# Altium schematic sheet Sensor Bank.SchDoc
size A4; DocumentNumber: 6; SheetNumber: 6; SheetTotal: 8
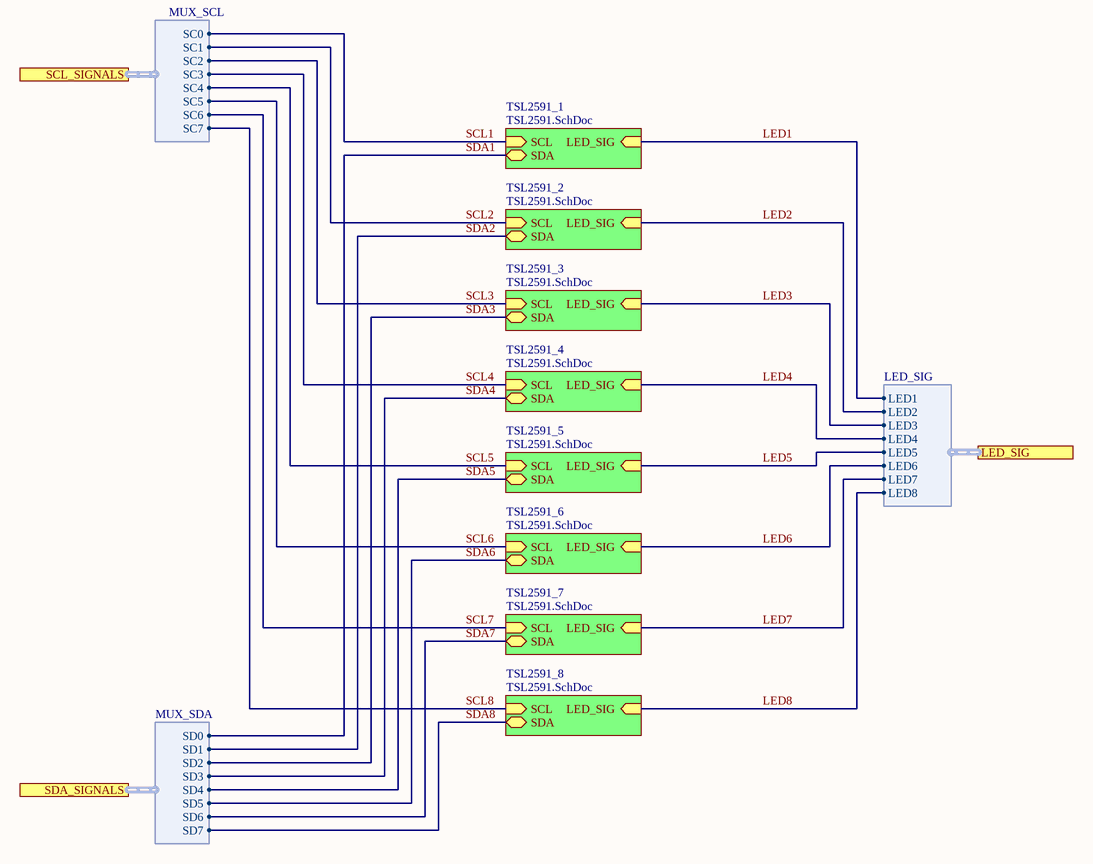
[diagram p0: Sensor Bank.SchDoc]

## Sub-sheets
TSL2591_1 = TSL2591.SchDoc: SCL (in), SDA (bidir), LED_SIG (in)
TSL2591_2 = TSL2591.SchDoc: SCL (in), SDA (bidir), LED_SIG (in)
TSL2591_3 = TSL2591.SchDoc: SCL (in), SDA (bidir), LED_SIG (in)
TSL2591_4 = TSL2591.SchDoc: SCL (in), SDA (bidir), LED_SIG (in)
TSL2591_5 = TSL2591.SchDoc: SCL (in), SDA (bidir), LED_SIG (in)
TSL2591_6 = TSL2591.SchDoc: SCL (in), SDA (bidir), LED_SIG (in)
TSL2591_7 = TSL2591.SchDoc: SCL (in), SDA (bidir), LED_SIG (in)
TSL2591_8 = TSL2591.SchDoc: SCL (in), SDA (bidir), LED_SIG (in)

## Ports
LED_SIG (harness LED_SIG), SCL_SIGNALS (harness MUX_SCL), SDA_SIGNALS (harness MUX_SDA)

## Harnesses
LED_SIG: LED1, LED2, LED3, LED4, LED5, LED6, LED7, LED8
MUX_SDA: SD0, SD1, SD2, SD3, SD4, SD5, SD6, SD7
MUX_SCL: SC0, SC1, SC2, SC3, SC4, SC5, SC6, SC7

## Nets
LED1: sheet TSL2591_1/LED_SIG, port LED_SIG.LED1
LED2: sheet TSL2591_2/LED_SIG, port LED_SIG.LED2
LED3: sheet TSL2591_3/LED_SIG, port LED_SIG.LED3
LED4: sheet TSL2591_4/LED_SIG, port LED_SIG.LED4
LED5: sheet TSL2591_5/LED_SIG, port LED_SIG.LED5
LED6: sheet TSL2591_6/LED_SIG, port LED_SIG.LED6
LED7: sheet TSL2591_7/LED_SIG, port LED_SIG.LED7
LED8: sheet TSL2591_8/LED_SIG, port LED_SIG.LED8
SCL1: sheet TSL2591_1/SCL, port SCL_SIGNALS.SC0
SCL2: sheet TSL2591_2/SCL, port SCL_SIGNALS.SC1
SCL3: sheet TSL2591_3/SCL, port SCL_SIGNALS.SC2
SCL4: sheet TSL2591_4/SCL, port SCL_SIGNALS.SC3
SCL5: sheet TSL2591_5/SCL, port SCL_SIGNALS.SC4
SCL6: sheet TSL2591_6/SCL, port SCL_SIGNALS.SC5
SCL7: sheet TSL2591_7/SCL, port SCL_SIGNALS.SC6
SCL8: sheet TSL2591_8/SCL, port SCL_SIGNALS.SC7
SDA1: sheet TSL2591_1/SDA, port SDA_SIGNALS.SD0
SDA2: sheet TSL2591_2/SDA, port SDA_SIGNALS.SD1
SDA3: sheet TSL2591_3/SDA, port SDA_SIGNALS.SD2
SDA4: sheet TSL2591_4/SDA, port SDA_SIGNALS.SD3
SDA5: sheet TSL2591_5/SDA, port SDA_SIGNALS.SD4
SDA6: sheet TSL2591_6/SDA, port SDA_SIGNALS.SD5
SDA7: sheet TSL2591_7/SDA, port SDA_SIGNALS.SD6
SDA8: sheet TSL2591_8/SDA, port SDA_SIGNALS.SD7